# Altium schematic sheet Sheet1.SchDoc
size A
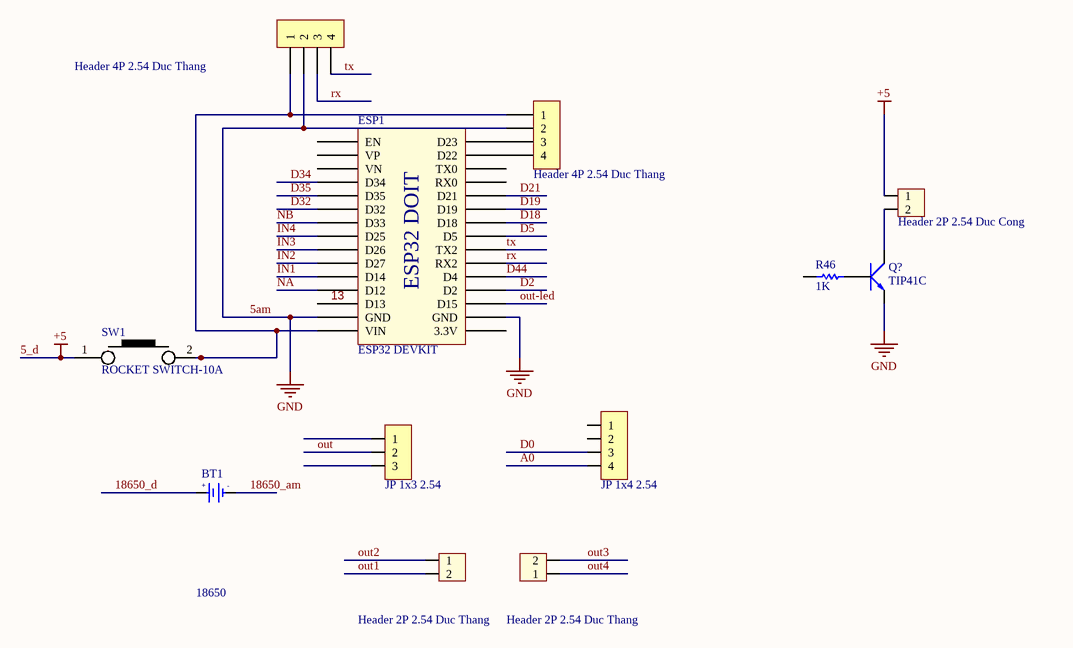
[diagram p0: Sheet1.SchDoc]

## Parts
BT1  18650  [DE PIN 18650 X2]
ESP1  ESP32 DEVKIT  [ESP32 WROOM 32 KIT]
H1  Header 4P 2.54 Duc Thang  [XH2.54M-4]
H2  Header 4P 2.54 Duc Thang  [XH2.54M-4]
H3  Header 2P 2.54 Duc Thang  [XH2.54M-2]
H4  Header 2P 2.54 Duc Thang  [XH2.54M-2]
H?  Header 2P 2.54 Duc Cong  [Header 2P DC 2.54]
JP1  JP 1x4 2.54  [JP 1x4 CT]
JP2  JP 1x3 2.54  [JP 1x3 CT]
Q?  TIP41C  [QTO-220]
R46  value 1K  [R1/4W]  (hidden comment: Res1)
SW1  ROCKET SWITCH-10A  [SW_2ARS_TH]

## Nets
5_d: H?.1 SW1.1  [also labelled +5]
5am: ESP1.14(GND) ESP1.17(GND) H1.2 H2.2 Q?.3(E)  [also labelled GND]
18650_am: BT1.2(GND)
18650_d: BT1.1(+3V)
A0: JP1.4
D0: JP1.3
D2: ESP1.19(D2)
D5: ESP1.23(D5)
D18: ESP1.24(D18)
D19: ESP1.25(D19)
D21: ESP1.26(D21)
D32: ESP1.6(D32)
D34: ESP1.4(D34)
D35: ESP1.5(D35)
D44: ESP1.20(D4)
IN1: ESP1.11(D14)
IN2: ESP1.10(D27)
IN3: ESP1.9(D26)
IN4: ESP1.8(D25)
NA: ESP1.12(D12)
NB: ESP1.7(D33)
out: JP2.2
out1: H3.2
out2: H3.1
out3: H4.2
out4: H4.1
out-led: ESP1.18(D15)
rx: ESP1.21(RX2) H1.3
tx: ESP1.22(TX2) H1.4
NetESP1_15: ESP1.15(VIN) H1.1 H2.1 SW1.2
NetESP1_29: ESP1.29(D22) H2.4
NetESP1_30: ESP1.30(D23) H2.3
NetH?_2: H?.2 Q?.2(C)
NetQ?_1: Q?.1(B) R46.1

Not connected (* = marked no-connect by the designer): ESP1 1(EN) 2(VP) 3(VN) 13(D13) 16(3.3V) 27(RX0) 28(TX0); JP1 1 2; JP2 1 3; R46 2

## Notes on the sheet
- Labels drawn without touching a wire or pin: 13
- (in symbol De Pin 18650 x2) +; -
- (in symbol ESP32 WROOM 32 KIT) ESP32 DOIT

## Library data of the parts
BT1 = De Pin 18650 x2: Ten: Hộp Đế Pin 18650 Hàn Mạch DP 18650-HM-02; Ma_Hang: MH010812
ESP1 = ESP32 WROOM 32 KIT
H1 H2 = Header 4P 2.54 Duc Thang: Cắm; Ten_Linh_Kien: Header 4P XH2.54-4P Đực Thẳng; Don_Vi: Con; Ma_Hang: MH001285; Chung_Loai: Cắm
H3 H4 = Header 2P 2.54 Duc Thang: Cắm; Ten_Linh_Kien: Header 2P XH2.54-2P Đực Thẳng; Don_Vi: Con; Ma_Hang: MH001283; Chung_Loai: Cắm
H? = Header 2P 2.54 Duc Cong: Cắm; Ten_Linh_Kien: Header 2P XH2.54-2P Đực Cong; Don_Vi: Con; Ma_Hang: MH002852; Chung_Loai: Cắm
JP1 = JP 1x4 2.54 Cai Thang: Cắm; Ten_Linh_Kien: Jump Đơn Cái 2.54MM 1x20P Thẳng; Don_Vi: Con; Ma_Hang: MH004006; Ghi_Chu: *; Kieu_Chan: *; Chung_Loai: Cắm
JP2 = JP 1x3 2.54 Cai Thang: Cắm; Ten_Linh_Kien: Jump Đơn Cái 2.54MM 1x20P Thẳng; Don_Vi: Con; Ma_Hang: MH004006; Ghi_Chu: *; Kieu_Chan: *; Chung_Loai: Cắm
Q? = TIP41C: NPN 2W, BCE; Value: TIP41C
R46 = Res1_1: Resistor; Manufacturer: Generic Components; Class: Passive; Published: 08/06/2000; Publisher: Altium Hobart Technology Centre; SubClass: Resistor
SW1 = SW1_10A-SRB23A2BBBNN-TH: Rocker Switch SPDT 10A (AC) 125V Panel Mount, Snap-In; Manufacturer: ITT C&K; Alternate Part Number-1: NA; Manufacturer Part Number: SRB23A2BBBNN; Case/Package: TH; Supplier-1: SP ROAD; Supplier Part Number-1: SRB23A2BBBNN